# EAGLE design DAQ and eCVT (EAGLE 9.5.2)

## Sheet 1 of 4
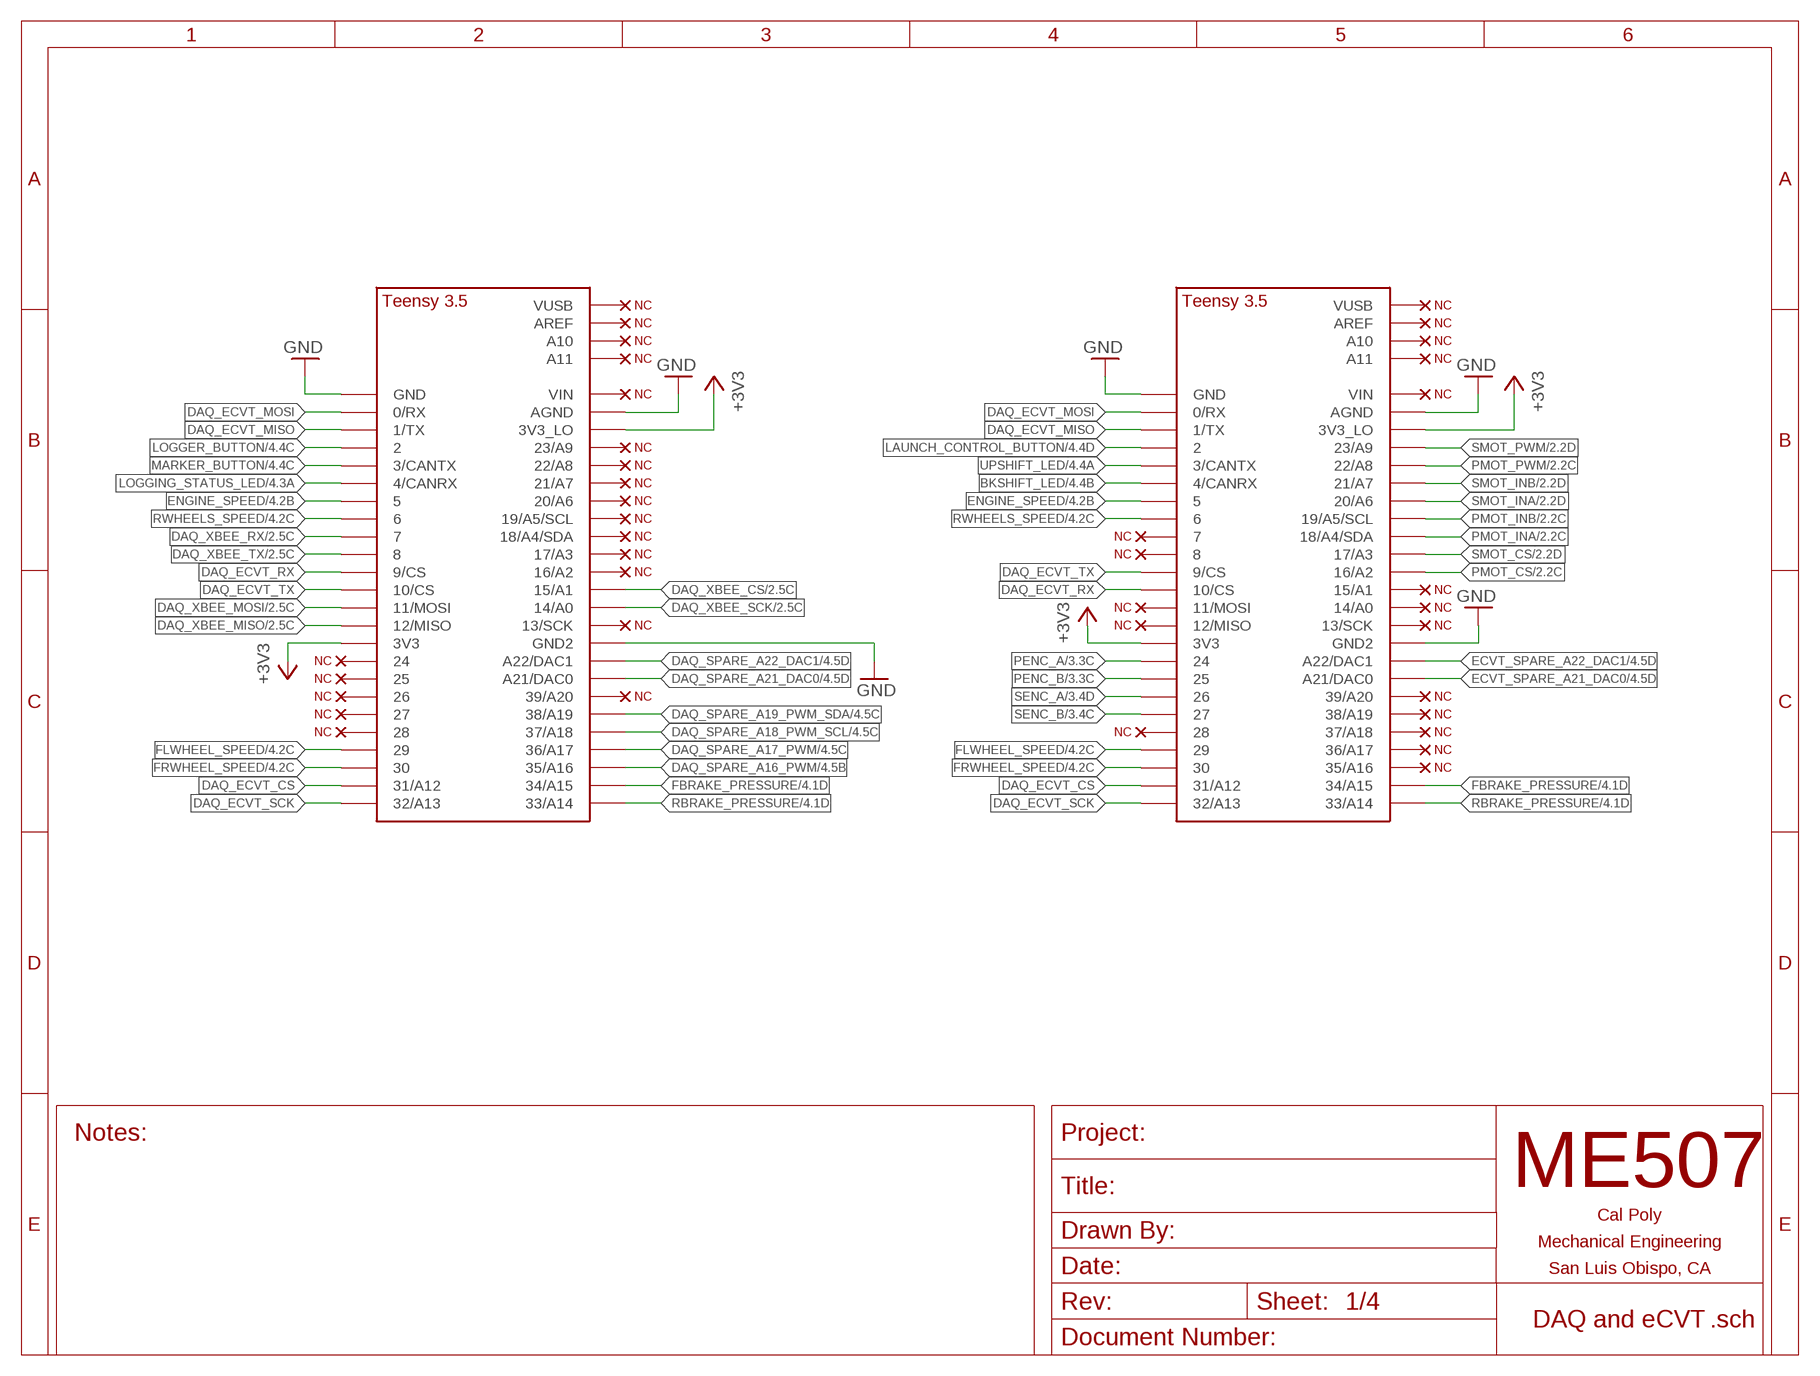
[diagram p0: schematic, sheet 1]

### Parts
DAQ  TEENSY_3.5  [TEENSY_3.5]
ECVT  TEENSY_3.5  [TEENSY_3.5]
U$3  NC  (no package)
U$4  NC  (no package)
U$5  NC  (no package)
U$6  NC  (no package)
U$7  NC  (no package)
U$8  NC  (no package)
U$9  NC  (no package)
U$10  NC  (no package)
U$11  NC  (no package)
U$12  NC  (no package)
U$13  NC  (no package)
U$14  NC  (no package)
U$15  NC  (no package)
U$16  NC  (no package)
U$17  NC  (no package)
U$18  NC  (no package)
U$19  NC  (no package)
U$20  NC  (no package)
U$21  NC  (no package)
U$22  NC  (no package)
U$23  NC  (no package)
U$24  NC  (no package)
U$25  NC  (no package)
U$26  NC  (no package)
U$27  NC  (no package)
U$36  NC  (no package)
U$37  NC  (no package)
U$38  NC  (no package)
U$39  NC  (no package)
U$40  NC  (no package)
U$41  NC  (no package)
U$42  NC  (no package)
U$43  NC  (no package)
U$44  NC  (no package)
U$45  NC  (no package)
U$46  NC  (no package)
U$55  NC  (no package)
U$56  NC  (no package)

### Nets
+3V3: DAQ.3V3 DAQ.3V3_LO ECVT.3V3 ECVT.3V3_LO ; also sheet 2,4
BKSHIFT_LED: ECVT.4/CANRX ; also sheet 4
DAQ_ECVT_CS: DAQ.31/A12 ECVT.31/A12
DAQ_ECVT_MISO: DAQ.1/TX ECVT.1/TX
DAQ_ECVT_MOSI: DAQ.0/RX ECVT.0/RX
DAQ_ECVT_RX: DAQ.9/CS ECVT.10/CS
DAQ_ECVT_SCK: DAQ.32/A13 ECVT.32/A13
DAQ_ECVT_TX: DAQ.10/CS ECVT.9/CS
DAQ_SPARE_A16_PWM: DAQ.35/A16 ; also sheet 4
DAQ_SPARE_A17_PWM: DAQ.36/A17 ; also sheet 4
DAQ_SPARE_A18_PWM_SCL: DAQ.37/A18 ; also sheet 4
DAQ_SPARE_A19_PWM_SDA: DAQ.38/A19 ; also sheet 4
DAQ_SPARE_A21_DAC0: DAQ.21/DAC0(A21/DAC0) ; also sheet 4
DAQ_SPARE_A22_DAC1: DAQ.A22/DAC1 ; also sheet 4
DAQ_XBEE_CS: DAQ.15/A1 ; also sheet 2
DAQ_XBEE_MISO: DAQ.12/MISO ; also sheet 2
DAQ_XBEE_MOSI: DAQ.11/MOSI ; also sheet 2
DAQ_XBEE_RX: DAQ.7 ; also sheet 2
DAQ_XBEE_SCK: DAQ.14/A0 ; also sheet 2
DAQ_XBEE_TX: DAQ.8 ; also sheet 2
ECVT_SPARE_A21_DAC0: ECVT.21/DAC0(A21/DAC0) ; also sheet 4
ECVT_SPARE_A22_DAC1: ECVT.A22/DAC1 ; also sheet 4
ENGINE_SPEED: DAQ.5 ECVT.5 ; also sheet 4
FBRAKE_PRESSURE: DAQ.34/A15 ECVT.34/A15 ; also sheet 4
FLWHEEL_SPEED: DAQ.29 ECVT.29 ; also sheet 4
FRWHEEL_SPEED: DAQ.30 ECVT.30 ; also sheet 4
GND: DAQ.AGND DAQ.GND DAQ.GND2 ECVT.AGND ECVT.GND ECVT.GND2 ; also sheet 2,3,4
LAUNCH_CONTROL_BUTTON: ECVT.2 ; also sheet 4
LOGGER_BUTTON: DAQ.2 ; also sheet 4
LOGGING_STATUS_LED: DAQ.4/CANRX ; also sheet 4
MARKER_BUTTON: DAQ.3/CANTX ; also sheet 4
N$2: DAQ.13/SCK U$4.D
N$3: DAQ.16/A2 U$5.D
N$4: DAQ.17/A3 U$6.D
N$5: DAQ.18/A4/SDA U$7.D
N$6: DAQ.19/A5/SCL U$8.D
N$7: DAQ.20/A6 U$9.D
N$8: DAQ.21/A7 U$10.D
N$9: DAQ.22/A8 U$11.D
N$10: DAQ.23/A9 U$12.D
N$11: DAQ.24 U$13.D
N$12: DAQ.25 U$14.D
N$13: DAQ.26 U$15.D
N$14: DAQ.27 U$16.D
N$15: DAQ.28 U$17.D
N$16: DAQ.VUSB U$18.D
N$17: DAQ.AREF U$19.D
N$18: DAQ.A10 U$20.D
N$19: DAQ.A11 U$21.D
N$20: DAQ.39/A20 U$22.D
N$22: ECVT.13/SCK U$3.D
N$23: ECVT.VUSB U$36.D
N$24: ECVT.28 U$23.D
N$25: ECVT.AREF U$37.D
N$26: ECVT.A10 U$38.D
N$27: ECVT.A11 U$39.D
N$28: ECVT.39/A20 U$40.D
N$29: ECVT.7 U$41.D
N$30: ECVT.8 U$42.D
N$31: ECVT.11/MOSI U$43.D
N$32: ECVT.12/MISO U$44.D
N$33: ECVT.14/A0 U$45.D
N$34: ECVT.15/A1 U$46.D
N$35: ECVT.35/A16 U$24.D
N$36: ECVT.36/A17 U$25.D
N$37: ECVT.37/A18 U$26.D
N$38: ECVT.38/A19 U$27.D
N$54: ECVT.VIN U$55.D
N$55: DAQ.VIN U$56.D
PENC_A: ECVT.24 ; also sheet 3
PENC_B: ECVT.25 ; also sheet 3
PMOT_CS: ECVT.16/A2 ; also sheet 2
PMOT_INA: ECVT.18/A4/SDA ; also sheet 2
PMOT_INB: ECVT.19/A5/SCL ; also sheet 2
PMOT_PWM: ECVT.22/A8 ; also sheet 2
RBRAKE_PRESSURE: DAQ.33/A14 ECVT.33/A14 ; also sheet 4
RWHEELS_SPEED: DAQ.6 ECVT.6 ; also sheet 4
SENC_A: ECVT.26 ; also sheet 3
SENC_B: ECVT.27 ; also sheet 3
SMOT_CS: ECVT.17/A3 ; also sheet 2
SMOT_INA: ECVT.20/A6 ; also sheet 2
SMOT_INB: ECVT.21/A7 ; also sheet 2
SMOT_PWM: ECVT.23/A9 ; also sheet 2
UPSHIFT_LED: ECVT.3/CANTX ; also sheet 4

## Sheet 2 of 4
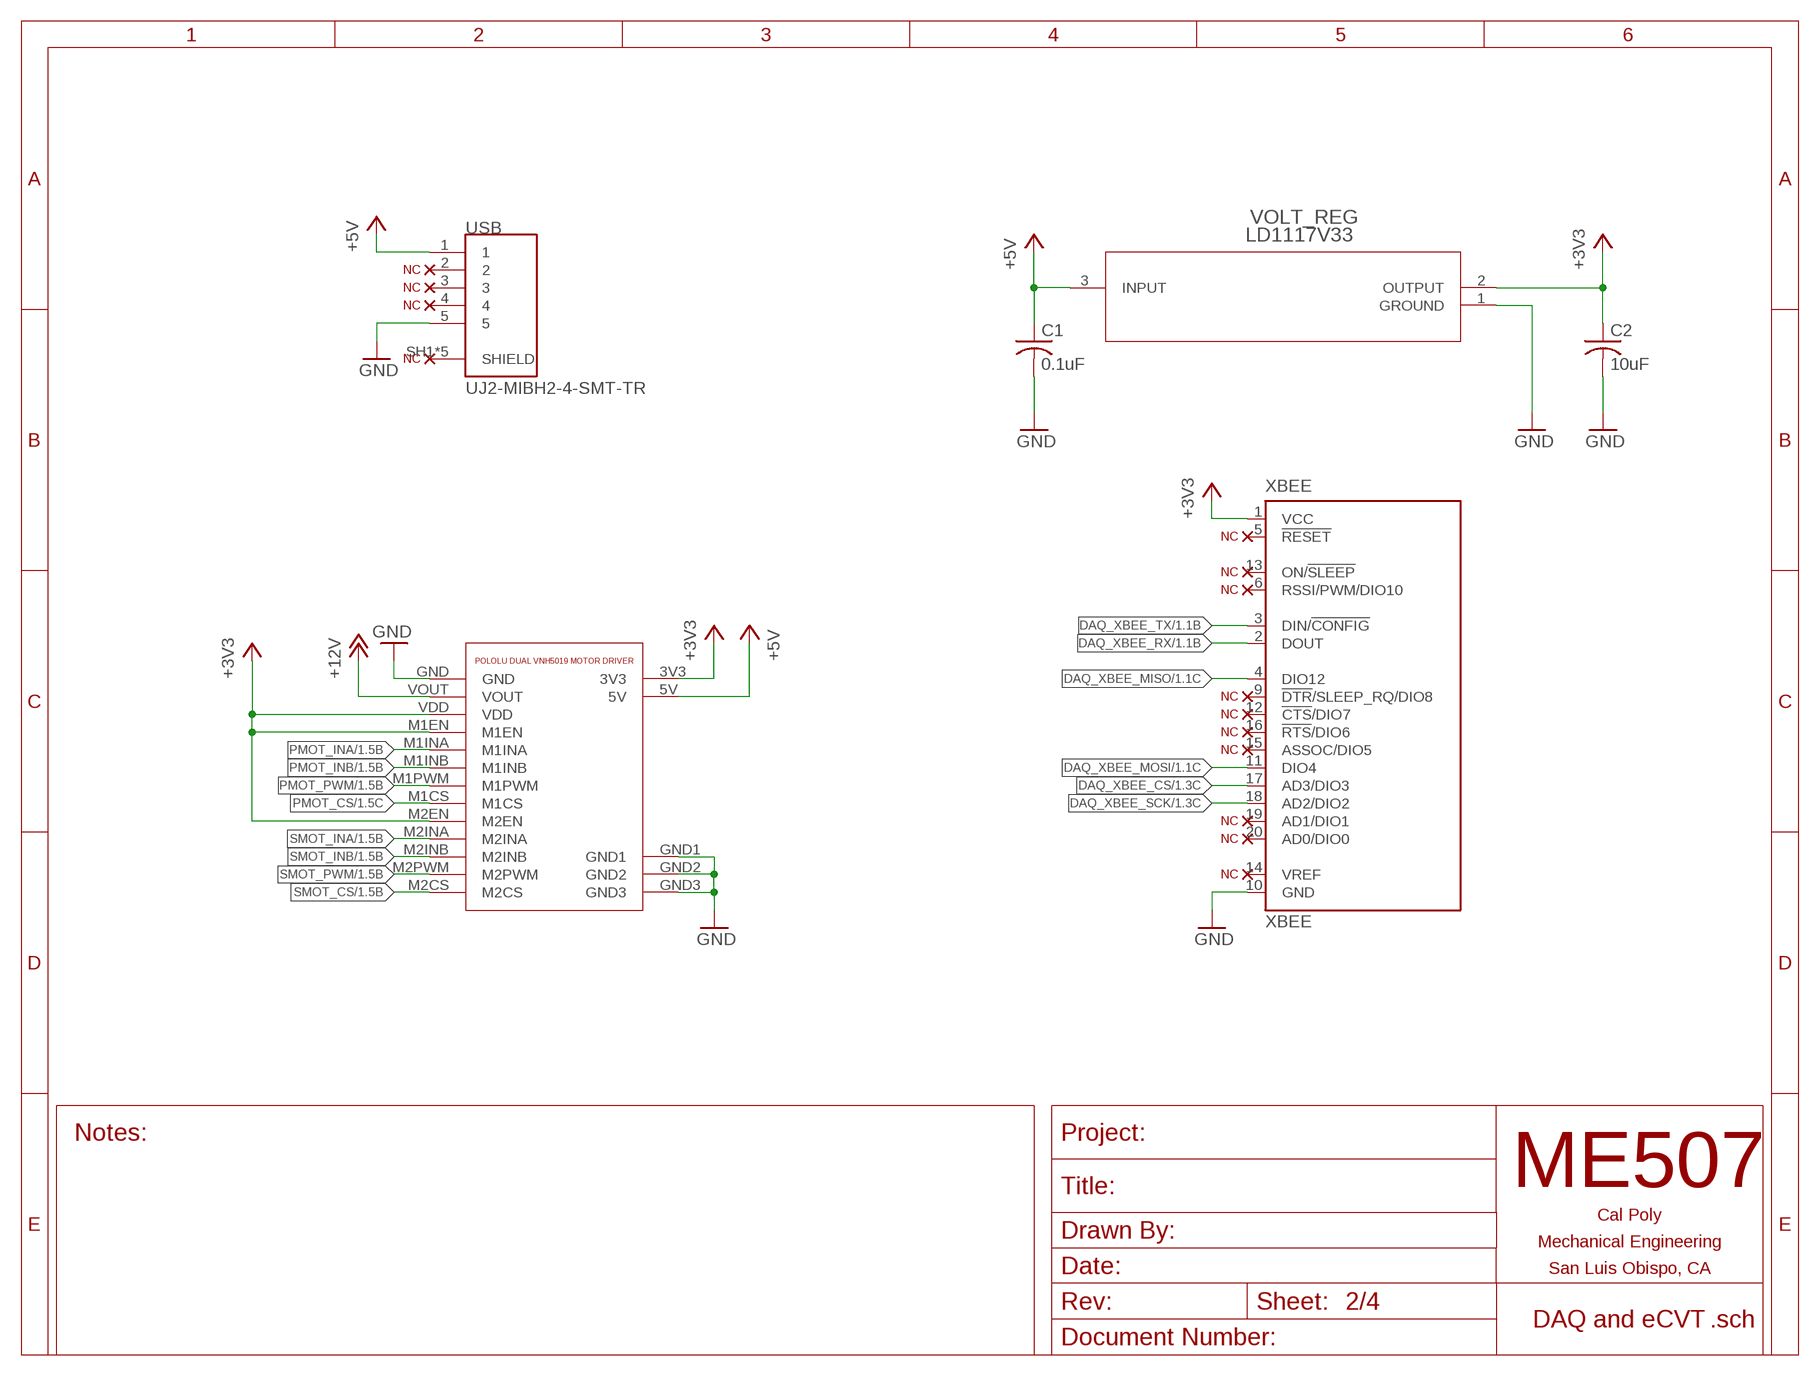
[diagram p1: schematic, sheet 2]

### Parts
C1  0.1uF  C-USC0805  [C0805]
C2  10uF  C-USC0805  [C0805]
MOTOR_DRIVER  POLOLU_DUAL_VNH5019  [POLOLU_DUAL_VNH5019]
U$28  NC  (no package)
U$29  NC  (no package)
U$30  NC  (no package)
U$31  NC  (no package)
U$34  NC  (no package)
U$35  NC  (no package)
U$47  NC  (no package)
U$48  NC  (no package)
U$49  NC  (no package)
U$50  NC  (no package)
U$51  NC  (no package)
U$52  NC  (no package)
U$53  NC  (no package)
U$54  NC  (no package)
USB  UJ2-MIBH2-4-SMT-TR  [CUI_UJ2-MIBH2-4-SMT-TR]
VOLT_REG  LD1117V33  [TO-220]
XBEE  XBEE  [XBEE]

### Nets
+3V3: C2.1 MOTOR_DRIVER.3V3 MOTOR_DRIVER.M1EN MOTOR_DRIVER.M2EN MOTOR_DRIVER.VDD VOLT_REG.2(OUTPUT) XBEE.1(VCC) ; also sheet 1,4
+5V: C1.1 MOTOR_DRIVER.5V USB.1 VOLT_REG.3(INPUT) ; also sheet 3,4
+12V: MOTOR_DRIVER.VOUT ; also sheet 4
DAQ_XBEE_CS: XBEE.17(AD3/DIO3) ; also sheet 1
DAQ_XBEE_MISO: XBEE.4(DIO12) ; also sheet 1
DAQ_XBEE_MOSI: XBEE.11(DIO4) ; also sheet 1
DAQ_XBEE_RX: XBEE.2(DOUT) ; also sheet 1
DAQ_XBEE_SCK: XBEE.18(AD2/DIO2) ; also sheet 1
DAQ_XBEE_TX: XBEE.3(DIN/!CONFIG) ; also sheet 1
GND: C1.2 C2.2 MOTOR_DRIVER.GND MOTOR_DRIVER.GND1 MOTOR_DRIVER.GND2 MOTOR_DRIVER.GND3 USB.5 VOLT_REG.1(GROUND) XBEE.10(GND) ; also sheet 1,3,4
N$1: U$28.D USB.2
N$21: U$29.D USB.3
N$39: U$30.D USB.4
N$40: U$31.D USB.SH1(SHIELD) USB.SH2(SHIELD) USB.SH3(SHIELD) USB.SH4(SHIELD) USB.SH5(SHIELD)
N$43: U$34.D XBEE.5(!RESET)
N$45: U$35.D XBEE.13(ON/!SLEEP)
N$46: U$47.D XBEE.6(RSSI/PWM/DIO10)
N$47: U$48.D XBEE.9(!DTR!/SLEEP_RQ/DIO8)
N$48: U$49.D XBEE.12(!CTS!/DIO7)
N$49: U$50.D XBEE.16(!RTS!/DIO6)
N$50: U$51.D XBEE.15(ASSOC/DIO5)
N$51: U$52.D XBEE.19(AD1/DIO1)
N$52: U$53.D XBEE.20(AD0/DIO0)
N$53: U$54.D XBEE.14(VREF)
PMOT_CS: MOTOR_DRIVER.M1CS ; also sheet 1
PMOT_INA: MOTOR_DRIVER.M1INA ; also sheet 1
PMOT_INB: MOTOR_DRIVER.M1INB ; also sheet 1
PMOT_PWM: MOTOR_DRIVER.M1PWM ; also sheet 1
SMOT_CS: MOTOR_DRIVER.M2CS ; also sheet 1
SMOT_INA: MOTOR_DRIVER.M2INA ; also sheet 1
SMOT_INB: MOTOR_DRIVER.M2INB ; also sheet 1
SMOT_PWM: MOTOR_DRIVER.M2PWM ; also sheet 1

## Sheet 3 of 4
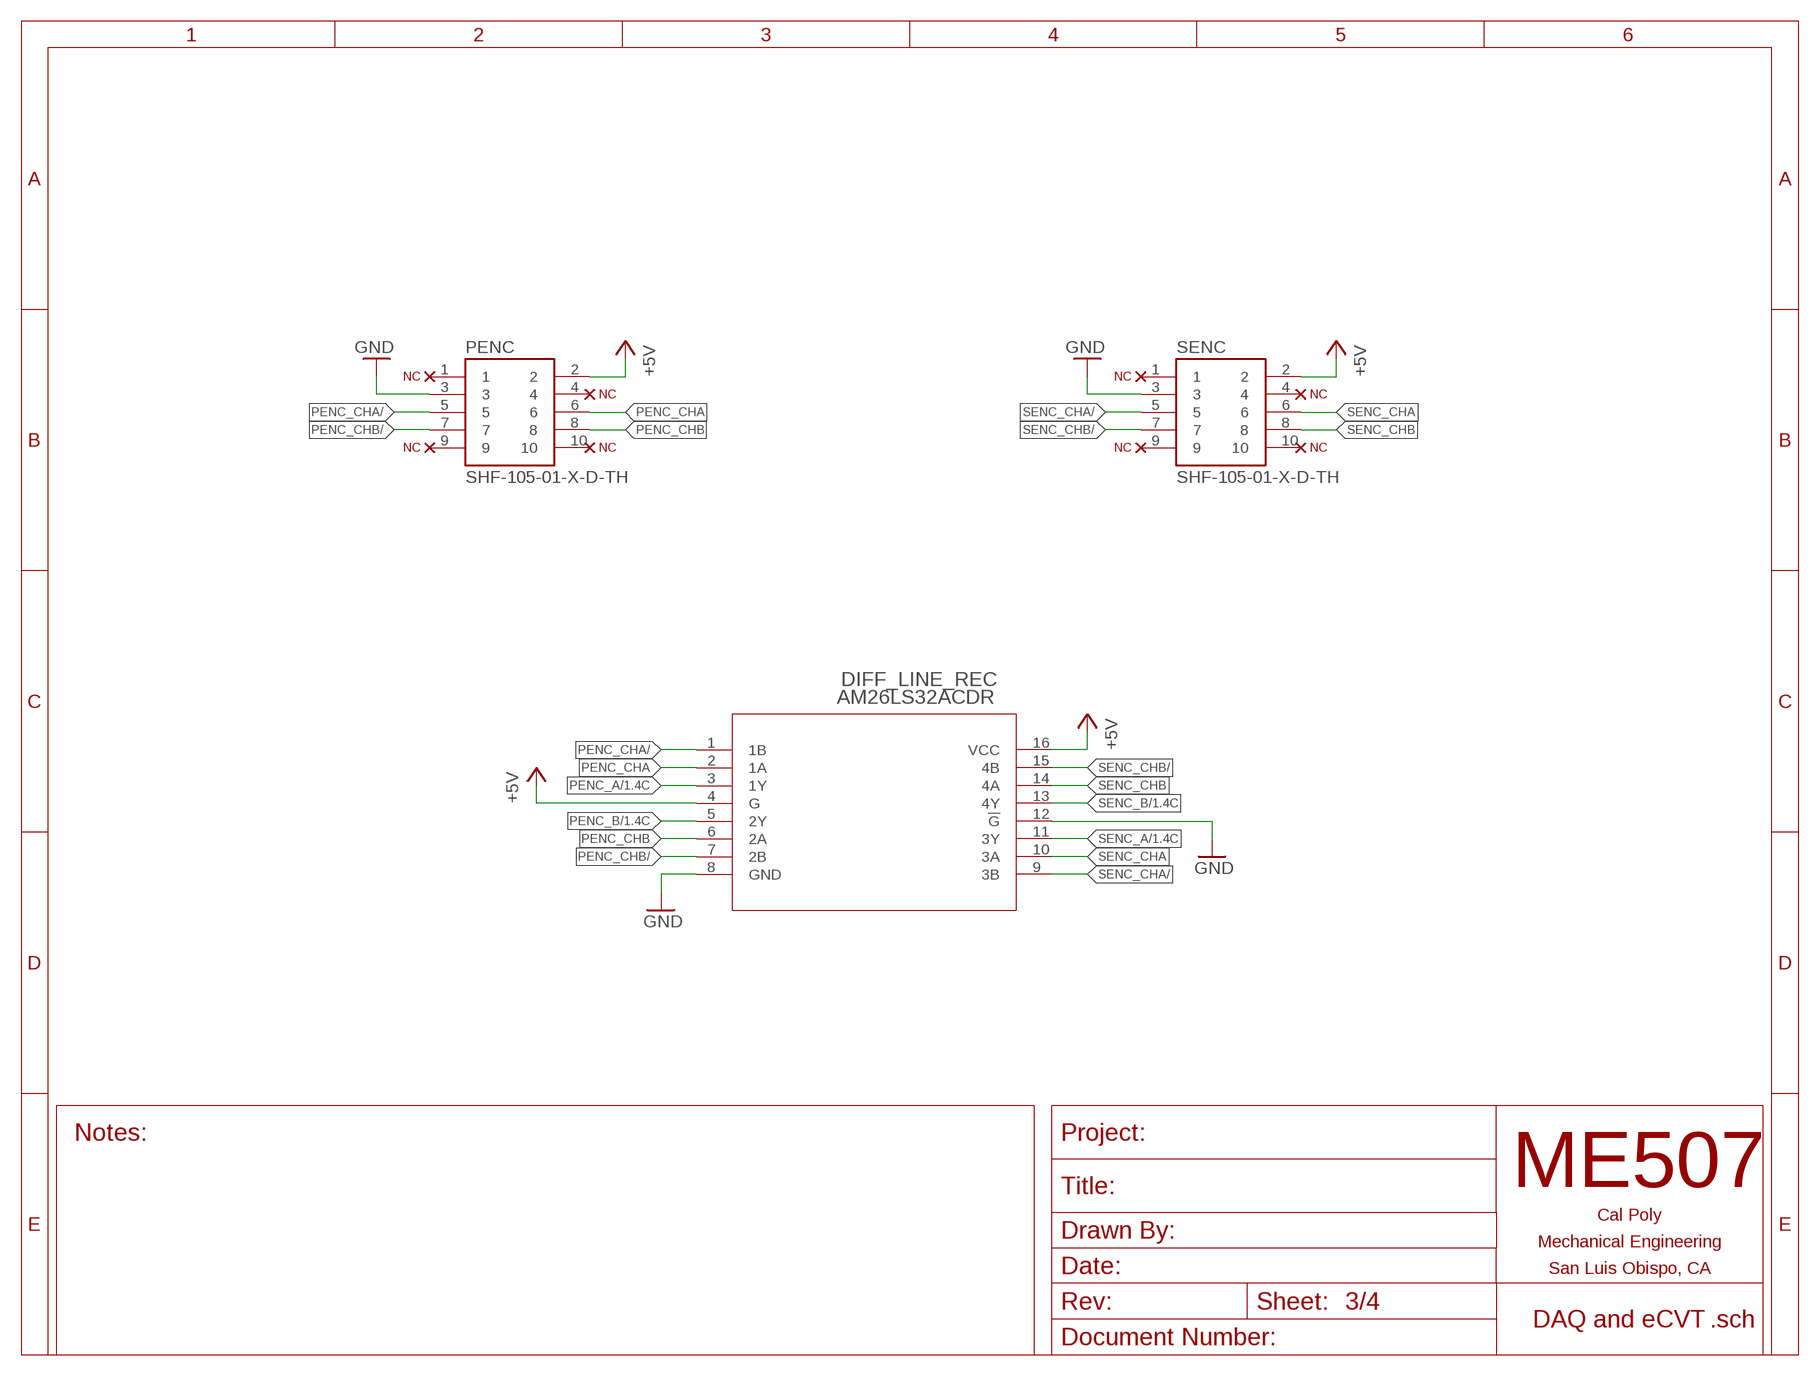
[diagram p2: schematic, sheet 3]

### Parts
DIFF_LINE_REC  AM26LS32ACDR  [D16]
PENC  SHF-105-01-X-D-TH  [SHF-105-01-X-D-TH]
SENC  SHF-105-01-X-D-TH  [SHF-105-01-X-D-TH]
U$59  NC  (no package)
U$60  NC  (no package)
U$61  NC  (no package)
U$62  NC  (no package)
U$63  NC  (no package)
U$64  NC  (no package)
U$65  NC  (no package)
U$66  NC  (no package)

### Nets
+5V: DIFF_LINE_REC.4(G) DIFF_LINE_REC.16(VCC) PENC.2 SENC.2 ; also sheet 2,4
GND: DIFF_LINE_REC.8(GND) DIFF_LINE_REC.12(!G) PENC.3 SENC.3 ; also sheet 1,2,4
N$56: PENC.9 U$61.D
N$59: PENC.10 U$62.D
N$64: PENC.4 U$59.D
N$65: PENC.1 U$60.D
N$68: SENC.4 U$63.D
N$69: SENC.10 U$64.D
N$70: SENC.1 U$65.D
N$71: SENC.9 U$66.D
PENC_A: DIFF_LINE_REC.3(1Y) ; also sheet 1
PENC_B: DIFF_LINE_REC.5(2Y) ; also sheet 1
PENC_CHA: DIFF_LINE_REC.2(1A) PENC.6
PENC_CHA/: DIFF_LINE_REC.1(1B) PENC.5
PENC_CHB: DIFF_LINE_REC.6(2A) PENC.8
PENC_CHB/: DIFF_LINE_REC.7(2B) PENC.7
SENC_A: DIFF_LINE_REC.11(3Y) ; also sheet 1
SENC_B: DIFF_LINE_REC.13(4Y) ; also sheet 1
SENC_CHA: DIFF_LINE_REC.10(3A) SENC.6
SENC_CHA/: DIFF_LINE_REC.9(3B) SENC.5
SENC_CHB: DIFF_LINE_REC.14(4A) SENC.8
SENC_CHB/: DIFF_LINE_REC.15(4B) SENC.7

## Sheet 4 of 4
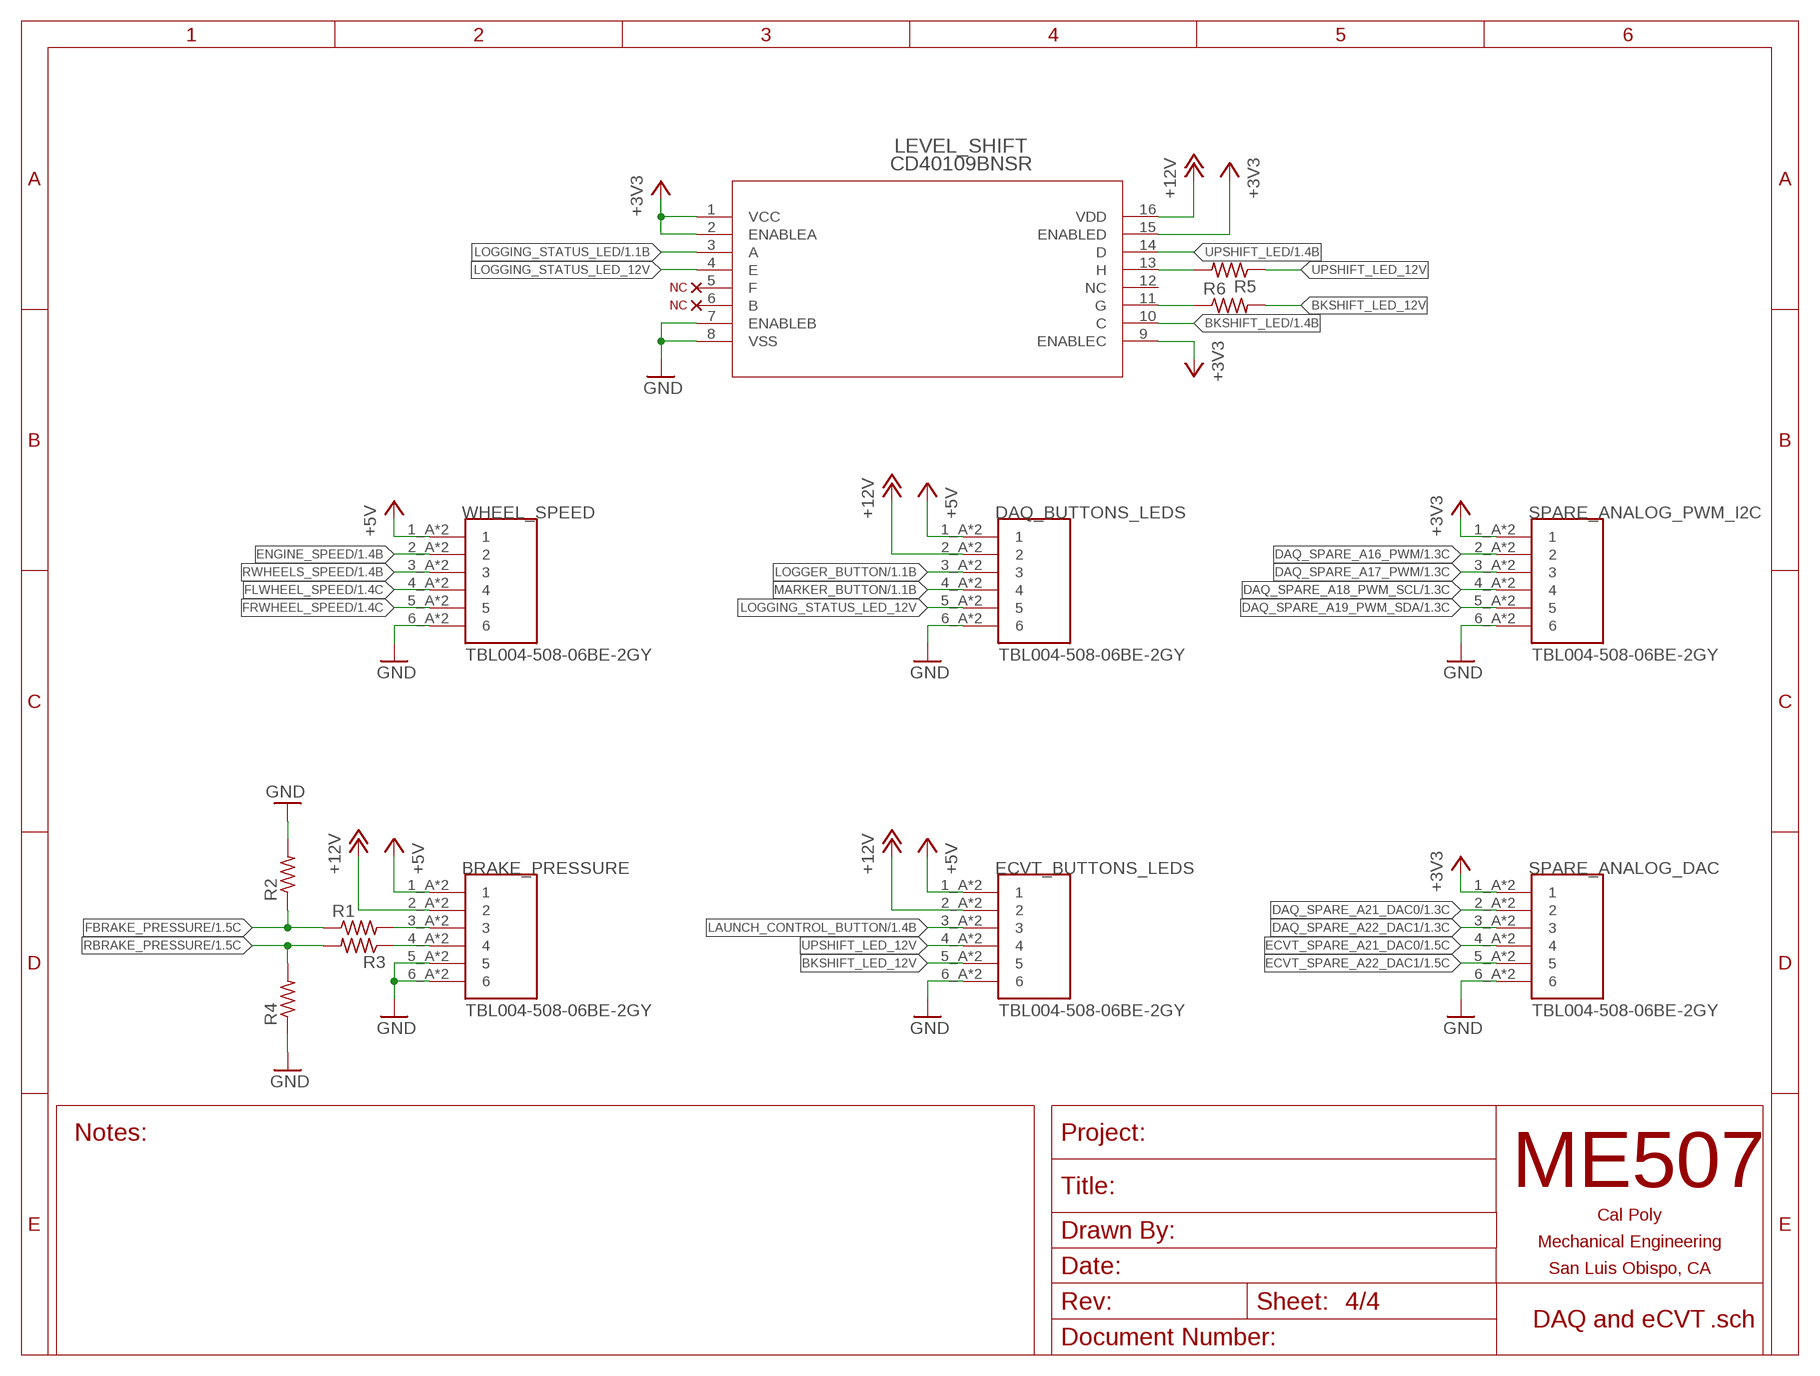
[diagram p3: schematic, sheet 4]

### Parts
BRAKE_PRESSURE  TBL004-508-06BE-2GY  [CUI_TBL004-508-06BE-2GY]
DAQ_BUTTONS_LEDS  TBL004-508-06BE-2GY  [CUI_TBL004-508-06BE-2GY]
ECVT_BUTTONS_LEDS  TBL004-508-06BE-2GY  [CUI_TBL004-508-06BE-2GY]
LEVEL_SHIFT  CD40109BNSR  [NS16]
R1  R-US_0204/7  [0204/7]
R2  R-US_0204/7  [0204/7]
R3  R-US_0204/7  [0204/7]
R4  R-US_0204/7  [0204/7]
R5  R-US_0204/7  [0204/7]
R6  R-US_0204/7  [0204/7]
SPARE_ANALOG_DAC  TBL004-508-06BE-2GY  [CUI_TBL004-508-06BE-2GY]
SPARE_ANALOG_PWM_I2C  TBL004-508-06BE-2GY  [CUI_TBL004-508-06BE-2GY]
U$67  NC  (no package)
U$68  NC  (no package)
WHEEL_SPEED  TBL004-508-06BE-2GY  [CUI_TBL004-508-06BE-2GY]

### Nets
+3V3: LEVEL_SHIFT.1(VCC) LEVEL_SHIFT.2(ENABLEA) LEVEL_SHIFT.9(ENABLEC) LEVEL_SHIFT.15(ENABLED) SPARE_ANALOG_DAC.1_A SPARE_ANALOG_DAC.1_B SPARE_ANALOG_PWM_I2C.1_A SPARE_ANALOG_PWM_I2C.1_B ; also sheet 1,2
+5V: BRAKE_PRESSURE.1_A BRAKE_PRESSURE.1_B DAQ_BUTTONS_LEDS.1_A DAQ_BUTTONS_LEDS.1_B ECVT_BUTTONS_LEDS.1_A ECVT_BUTTONS_LEDS.1_B WHEEL_SPEED.1_A WHEEL_SPEED.1_B ; also sheet 2,3
+12V: BRAKE_PRESSURE.2_A BRAKE_PRESSURE.2_B DAQ_BUTTONS_LEDS.2_A DAQ_BUTTONS_LEDS.2_B ECVT_BUTTONS_LEDS.2_A ECVT_BUTTONS_LEDS.2_B LEVEL_SHIFT.16(VDD) ; also sheet 2
BACKSHIFT_LED_12V_W/O_RES: LEVEL_SHIFT.11(G) R6.1
BKSHIFT_LED: LEVEL_SHIFT.10(C) ; also sheet 1
BKSHIFT_LED_12V: ECVT_BUTTONS_LEDS.5_A ECVT_BUTTONS_LEDS.5_B R6.2
DAQ_SPARE_A16_PWM: SPARE_ANALOG_PWM_I2C.2_A SPARE_ANALOG_PWM_I2C.2_B ; also sheet 1
DAQ_SPARE_A17_PWM: SPARE_ANALOG_PWM_I2C.3_A SPARE_ANALOG_PWM_I2C.3_B ; also sheet 1
DAQ_SPARE_A18_PWM_SCL: SPARE_ANALOG_PWM_I2C.4_A SPARE_ANALOG_PWM_I2C.4_B ; also sheet 1
DAQ_SPARE_A19_PWM_SDA: SPARE_ANALOG_PWM_I2C.5_A SPARE_ANALOG_PWM_I2C.5_B ; also sheet 1
DAQ_SPARE_A21_DAC0: SPARE_ANALOG_DAC.2_A SPARE_ANALOG_DAC.2_B ; also sheet 1
DAQ_SPARE_A22_DAC1: SPARE_ANALOG_DAC.3_A SPARE_ANALOG_DAC.3_B ; also sheet 1
ECVT_SPARE_A21_DAC0: SPARE_ANALOG_DAC.4_A SPARE_ANALOG_DAC.4_B ; also sheet 1
ECVT_SPARE_A22_DAC1: SPARE_ANALOG_DAC.5_A SPARE_ANALOG_DAC.5_B ; also sheet 1
ENGINE_SPEED: WHEEL_SPEED.2_A WHEEL_SPEED.2_B ; also sheet 1
FBRAKE_PRESSURE: R1.1 R2.1 ; also sheet 1
FBRAKE_PRESSURE_W/O_RES: BRAKE_PRESSURE.3_A BRAKE_PRESSURE.3_B R1.2
FLWHEEL_SPEED: WHEEL_SPEED.4_A WHEEL_SPEED.4_B ; also sheet 1
FRWHEEL_SPEED: WHEEL_SPEED.5_A WHEEL_SPEED.5_B ; also sheet 1
GND: BRAKE_PRESSURE.5_A BRAKE_PRESSURE.5_B BRAKE_PRESSURE.6_A BRAKE_PRESSURE.6_B DAQ_BUTTONS_LEDS.6_A DAQ_BUTTONS_LEDS.6_B ECVT_BUTTONS_LEDS.6_A ECVT_BUTTONS_LEDS.6_B LEVEL_SHIFT.7(ENABLEB) LEVEL_SHIFT.8(VSS) R2.2 R4.1 SPARE_ANALOG_DAC.6_A SPARE_ANALOG_DAC.6_B SPARE_ANALOG_PWM_I2C.6_A SPARE_ANALOG_PWM_I2C.6_B WHEEL_SPEED.6_A WHEEL_SPEED.6_B ; also sheet 1,2,3
LAUNCH_CONTROL_BUTTON: ECVT_BUTTONS_LEDS.3_A ECVT_BUTTONS_LEDS.3_B ; also sheet 1
LOGGER_BUTTON: DAQ_BUTTONS_LEDS.3_A DAQ_BUTTONS_LEDS.3_B ; also sheet 1
LOGGING_STATUS_LED: LEVEL_SHIFT.3(A) ; also sheet 1
LOGGING_STATUS_LED_12V: DAQ_BUTTONS_LEDS.5_A DAQ_BUTTONS_LEDS.5_B LEVEL_SHIFT.4(E)
MARKER_BUTTON: DAQ_BUTTONS_LEDS.4_A DAQ_BUTTONS_LEDS.4_B ; also sheet 1
N$58: LEVEL_SHIFT.5(F) U$67.D
N$60: LEVEL_SHIFT.6(B) U$68.D
RBRAKE_PRESSURE: R3.2 R4.2 ; also sheet 1
RBRAKE_PRESSURE_W/O_RES: BRAKE_PRESSURE.4_A BRAKE_PRESSURE.4_B R3.1
RWHEELS_SPEED: WHEEL_SPEED.3_A WHEEL_SPEED.3_B ; also sheet 1
UPSHIFT_LED: LEVEL_SHIFT.14(D) ; also sheet 1
UPSHIFT_LED_12V: ECVT_BUTTONS_LEDS.4_A ECVT_BUTTONS_LEDS.4_B R5.1
UPSHIFT_LED_12V_W/O_RES: LEVEL_SHIFT.13(H) R5.2
Unconnected: LEVEL_SHIFT.12(NC)

## Library data of the parts
BRAKE_PRESSURE DAQ_BUTTONS_LEDS ECVT_BUTTONS_LEDS SPARE_ANALOG_DAC SPARE_ANALOG_PWM_I2C WHEEL_SPEED = Screwless Terminal 6-Pole:TBL004-508-06BE-2GY; MANUFACTURER: CUI; STANDARD: Manufacturer Recommendations
C1 C2 = rcl:C-US: CAPACITOR, American symbol; SPICEPREFIX: C
DAQ ECVT = Teensy:TEENSY_3.5
DIFF_LINE_REC = Quad. Diff. Line Receiver:AM26LS32ACDR; BUILT_BY: EMA_UL_Team; MANUFACTURER: Texas Instruments; MANUFACTURER_PART_NUMBER: AM26LS32ACDR; VENDOR: Texas Instruments
LEVEL_SHIFT = Quad. Level Shifter:CD40109BNSR; BUILT_BY: EMA_UL_Team; MANUFACTURER: Texas Instruments; MANUFACTURER_PART_NUMBER: CD40109BNSR; VENDOR: Texas Instruments
MOTOR_DRIVER = Pololo Dual VNH5019:POLOLU_DUAL_VNH5019
PENC SENC = Male Header 2x5 0.05in:SHF-105-01-X-D-TH: .050 x .050 SHROUDED TERMINAL STRIP.; DESCRIPTION: SHF Series .050 Shrouded Terminal Strip For FFSD; DIGI-KEY_PART_NUMBER: SAM10711-ND; DIGI-KEY_PURCHASE_URL: https://www.digikey.com/product-detail/en/samtec-inc/SHF-105-01-L-D-TH/SAM10711-ND/6561671?utm_source=snapeda&utm_medium=aggregator&utm_campaign=symbol; MF: Samtec; MP: SHF-105-01-L-D-TH; PACKAGE: None
R1-R6 = rcl:R-US_: RESISTOR, American symbol; SPICEPREFIX: R
U$3-U$31 U$34-U$56 = ME507:NC
U$59-U$68 = ME 507:NC
USB = Micro USB:UJ2-MIBH2-4-SMT-TR: Micro B Type 5 Pin Horizontal 30 µin Plating SMT USB Jack 2.0; CUI_PURCHASE_URL: https://www.cuidevices.com/product/interconnect/connectors/usb-connectors/uj2-mibh2-4-smt?utm_source=snapeda.com&utm_medium=referral&utm_campaign=snapedaBOM; DESCRIPTION: Micro B, USB 2.0, 1.8 A, Right Angle, Surface Mount _SMT_, USB Receptacle; DIGI-KEY_PART_NUMBER: 102-4007-1-ND; DIGI-KEY_PURCHASE_URL: https://www.digikey.com/product-detail/en/cui-devices/UJ2-MIBH2-4-SMT-TR/102-4007-1-ND/6187929?utm_source=snapeda&utm_medium=aggregator&utm_campaign=symbol; MF: CUI Devices; MP: UJ2-MIBH2-4-SMT-TR; PACKAGE: None
VOLT_REG = Voltage Regulator 3.3V:LD1117V33; BUILT_BY: EMA_UL_Team; MANUFACTURER_PART_NUMBER: LD1117V33; VENDOR: STMicroelectronics
XBEE = Xbee:XBEE: XBee (TM) /XBee-PRO(TM) OEM RF Modules Source: MaxStream, Inc. xbee_productmanual.pdf; MPN: XBP24-Z7UIT-004; OC_FARNELL: 1751799; OC_NEWARK: 34R5507

## Board
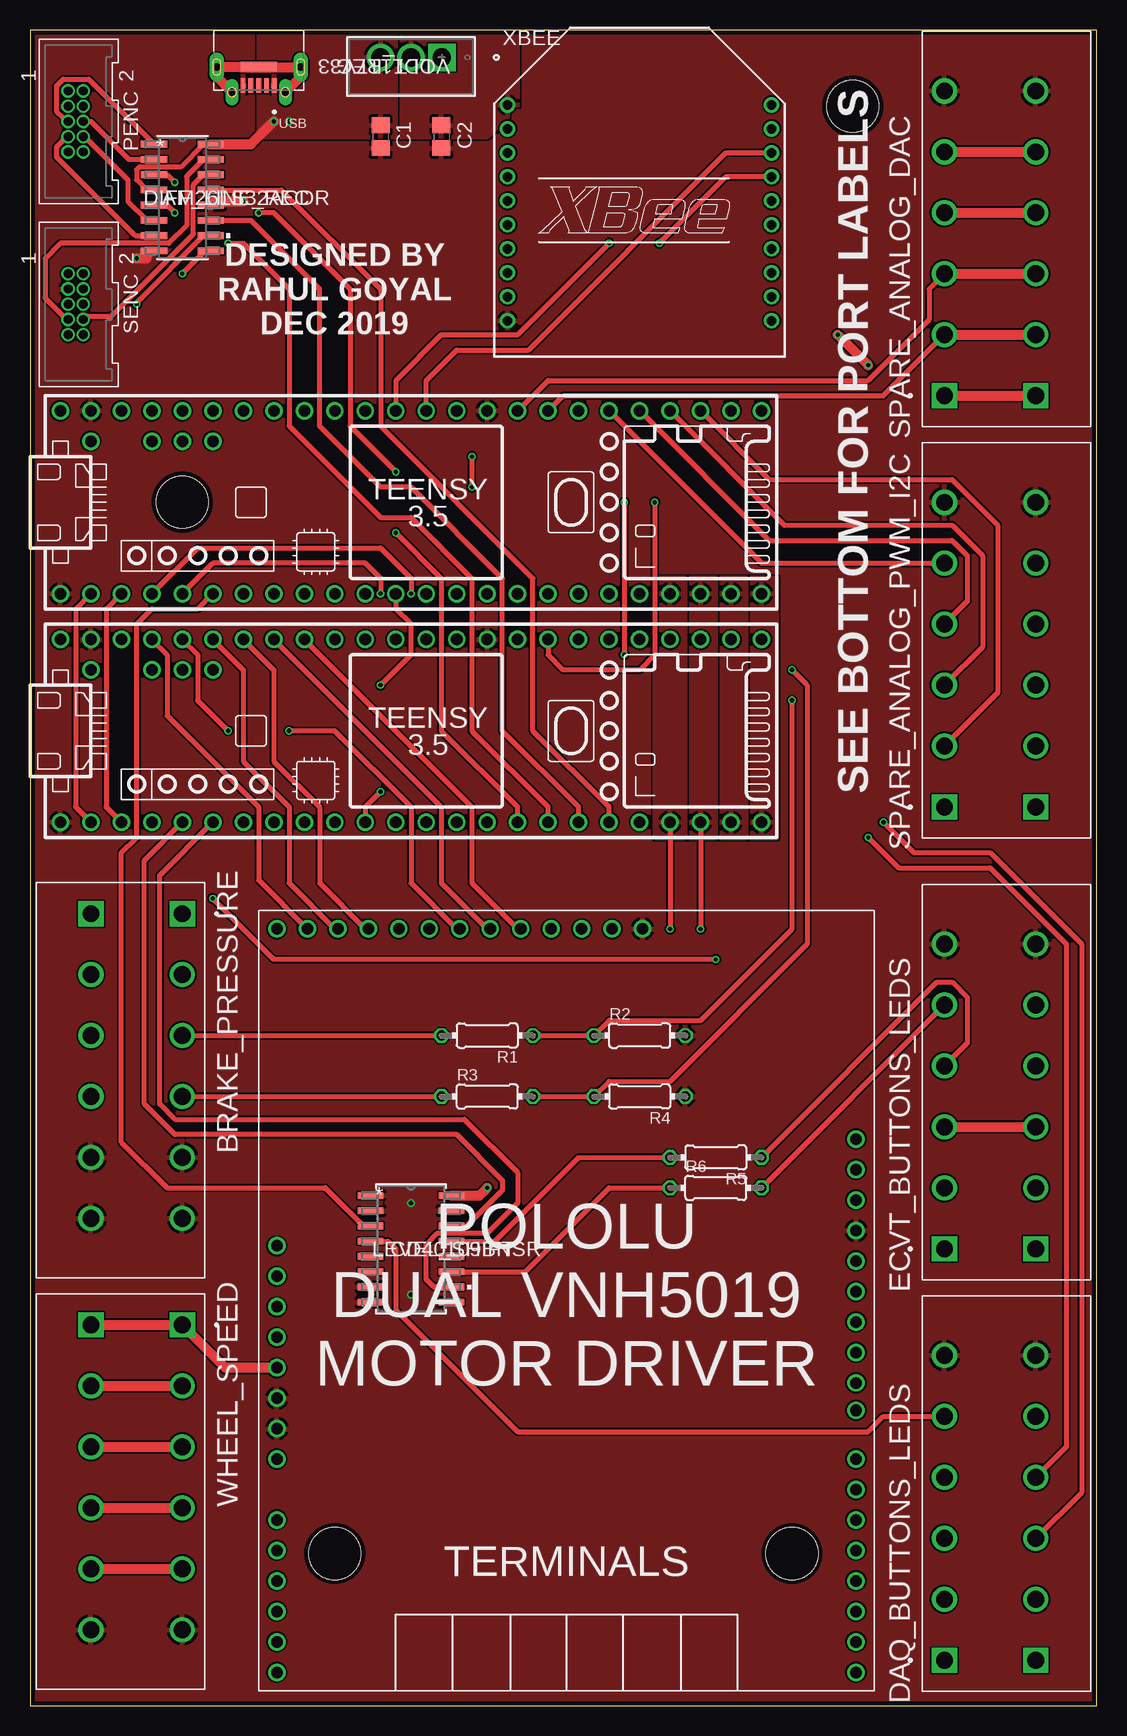
[diagram p4: board, top side]
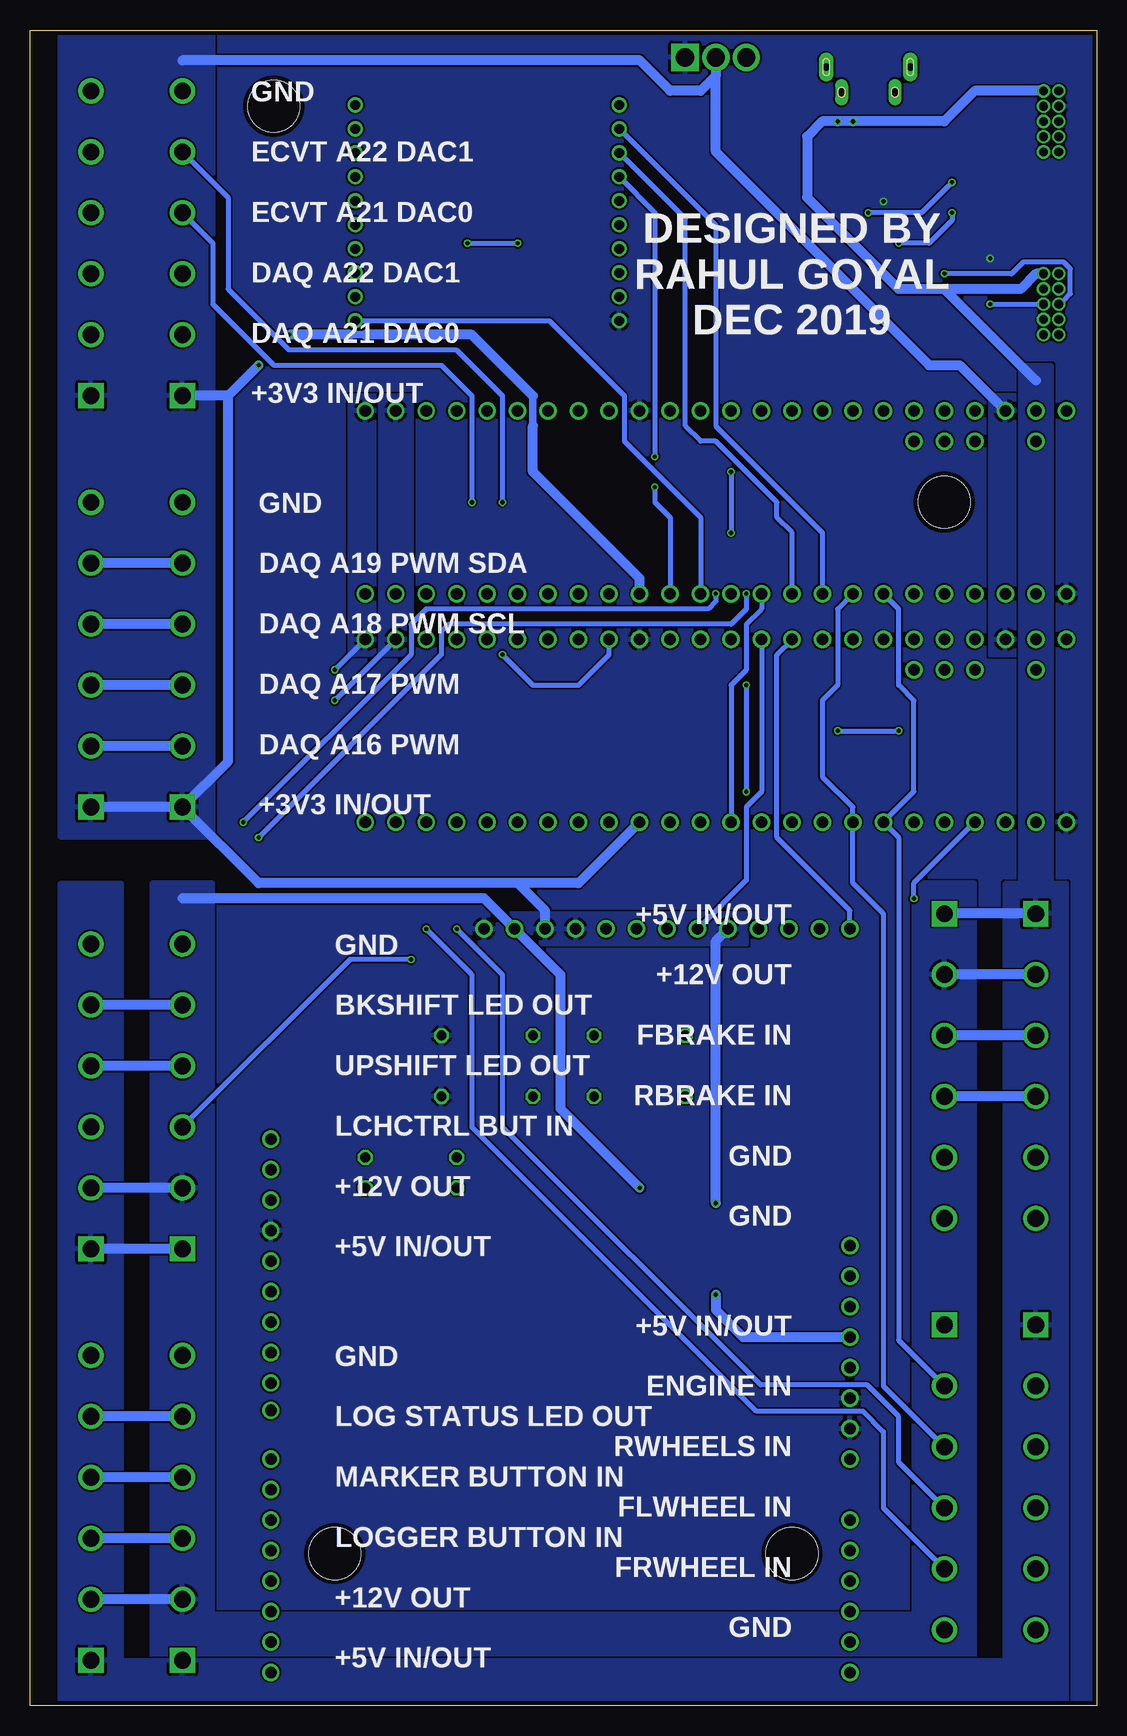
[diagram p5: board, bottom side, seen from below]

Size 88.9 x 139.7 mm. Coordinates in mm from the lower left corner, seen from the top.
Outline: 0,0 88.88,0 88.9,139.7 0,139.7 0,0
Copper layers (1*16): Top 0.035559375mm / dielectric 1.6mm / Bottom 0.035559375mm
Design rules "oshpark-2layer": minimum track width 6mil, minimum drill 10mil, track to track 6mil, track to pad 6mil, pad to pad 6mil, via to via 6mil, smd to smd 6mil, copper to edge 15mil, drill to drill 6mil, minimum pad ring 5mil, minimum via ring 5mil, stop-mask expansion 2.5mil, vias tented up to drill 0mil, thermal gap 10mil
Holes 4.32 mm at 25.4,12.7 63.5,12.7 12.7,100.33 68.58,133.35

### Footprints (pad centres in the part's own frame; a part is rotated, then mirrored left to right if it is on the bottom)
CUI_TBL004-508-06BE-2GY = drill 1.4 square: 1_A 0,0; 1_B 0,-7.62 | drill 1.4: 2_A 5.08,0; 2_B 5.08,-7.62; 3_A 10.16,0; 3_B 10.16,-7.62; 4_A 15.24,0; 4_B 15.24,-7.62; 5_A 20.32,0; 5_B 20.32,-7.62; 6_A 25.4,0; 6_B 25.4,-7.62
C0805 = smd 1.3 x 1.5: 1 -0.95,0; 2 0.95,0
TEENSY_3.5 = drill 0.965: 0/RX 3.81,1.27; 1/TX 6.35,1.27; 2 8.89,1.27; 3/CANTX 11.43,1.27; 3V3 36.83,1.27; 3V3_LO 6.35,16.51; 4/CANRX 13.97,1.27; 5 16.51,1.27; 6 19.05,1.27; 7 21.59,1.27; 8 24.13,1.27; 9/CS 26.67,1.27; 10/CS 29.21,1.27; 11/MOSI 31.75,1.27; 12/MISO 34.29,1.27; 13/SCK 34.29,16.51; 14/A0 31.75,16.51; 15/A1 29.21,16.51; 16/A2 26.67,16.51; 17/A3 24.13,16.51; 18/A4/SDA 21.59,16.51; 19/A5/SCL 19.05,16.51; 20/A6 16.51,16.51; 21/A7 13.97,16.51; 21/DAC0 41.91,16.51; 22/A8 11.43,16.51; 23/A9 8.89,16.51; 24 39.37,1.27; 25 41.91,1.27; 26 44.45,1.27; 27 46.99,1.27; 28 49.53,1.27; 29 52.07,1.27; 30 54.61,1.27; 31/A12 57.15,1.27; 32/A13 59.69,1.27; 33/A14 59.69,16.51; 34/A15 57.15,16.51; 35/A16 54.61,16.51; 36/A17 52.07,16.51; 37/A18 49.53,16.51; 38/A19 46.99,16.51; 39/A20 44.45,16.51; A10 11.43,13.97; A11 13.97,13.97; A22/DAC1 39.37,16.51; AGND 3.81,16.51; AREF 8.89,13.97; GND 1.27,1.27; GND2 36.83,16.51; VIN 1.27,16.51; VUSB 3.81,13.97
D16 = smd 2.184 x 0.559: 1 -2.362,4.445; 2 -2.362,3.175; 3 -2.362,1.905; 4 -2.362,0.635; 5 -2.362,-0.635; 6 -2.362,-1.905; 7 -2.362,-3.175; 8 -2.362,-4.445; 9 2.362,-4.445; 10 2.362,-3.175; 11 2.362,-1.905; 12 2.362,-0.635; 13 2.362,0.635; 14 2.362,1.905; 15 2.362,3.175; 16 2.362,4.445
NS16 = smd 2.159 x 0.559: 1 -3.378,4.445; 2 -3.378,3.175; 3 -3.378,1.905; 4 -3.378,0.635; 5 -3.378,-0.635; 6 -3.378,-1.905; 7 -3.378,-3.175; 8 -3.378,-4.445; 9 3.378,-4.445; 10 3.378,-3.175; 11 3.378,-1.905; 12 3.378,-0.635; 13 3.378,0.635; 14 3.378,1.905; 15 3.378,3.175; 16 3.378,4.445
POLOLU_DUAL_VNH5019 = drill 0.965: 0 49.784,1.524; 1 49.784,4.064; 2 49.784,6.604; 3 49.784,9.144; 3V3 1.524,29.464; 4 49.784,11.684; 5 49.784,14.224; 5V 1.524,26.924; 6 49.784,16.764; 7 49.784,19.304; 8 49.784,23.368; 9 49.784,25.654; 10 49.784,28.194; 11 49.784,30.734; 12 49.784,33.274; 13 49.784,35.814; 14 1.524,14.224; 15 1.524,11.684; 16 1.524,9.144; 17 1.524,6.604; 18 49.784,43.434; 19 49.784,45.974; 20 1.524,4.064; 21 1.524,1.524; AREF 49.784,40.894; GND 32.004,63.5; GND1 1.524,24.384; GND2 1.524,21.844; GND3 49.784,38.354; IOREF 1.524,34.544; M1CS 14.224,63.5; M1EN 24.384,63.5; M1INA 21.844,63.5; M1INB 19.304,63.5; M1PWM 16.764,63.5; M2CS 1.524,63.5; M2EN 11.684,63.5; M2INA 9.144,63.5; M2INB 6.604,63.5; M2PWM 4.064,63.5; NC 1.524,37.084; RESET 1.524,32.004; VDD 26.924,63.5; VIN 1.524,19.304; VOUT 29.464,63.5
SHF-105-01-X-D-TH = drill 0.737 pad 1.067: 1 -2.54,-0.635; 2 -2.54,0.635; 3 -1.27,-0.635; 4 -1.27,0.635; 5 0,-0.635; 6 0,0.635; 7 1.27,-0.635; 8 1.27,0.635; 9 2.54,-0.635; 10 2.54,0.635
0204/7 = drill 0.813 octagon: 1 -3.81,0; 2 3.81,0
CUI_UJ2-MIBH2-4-SMT-TR = smd 0.4 x 1.2: 1 -1.3,2.1; 2 -0.65,2.1; 3 0,2.1; 4 0.65,2.1; 5 1.3,2.1 | drill 0.6 pad 1.2 long: SH1 -3.5,0.55; SH4 3.5,0.55 | drill 0.65 pad 1.1 long: SH2 -2.225,2.65; SH3 2.225,2.65 | smd 3 x 0.9: SH5 0,0.55
TO-220 = drill 1.524 pad 2.032 square: 1 -5.105,-1.524 | drill 1.524 pad 2.032: 2 -2.54,-1.524; 3 0,-1.524
XBEE = drill 0.8 pad 1.27: 1 -11,9; 2 -11,7; 3 -11,5; 4 -11,3; 5 -11,1; 6 -11,-1; 7 -11,-3; 8 -11,-5; 9 -11,-7; 10 -11,-9; 11 11,-9; 12 11,-7; 13 11,-5; 14 11,-3; 15 11,-1; 16 11,1; 17 11,3; 18 11,5; 19 11,7; 20 11,9

### Placement (x,y rotation side)
BRAKE_PRESSURE  12.7,66.04 270 top
C1  29.21,130.81 270 top
C2  34.29,130.81 270 top
DAQ  1.27,91.44 0 top
DAQ_BUTTONS_LEDS  76.2,3.81 90 top
DIFF_LINE_REC  12.7,125.73 0 top
ECVT  1.27,72.39 0 top
ECVT_BUTTONS_LEDS  76.2,38.1 90 top
LEVEL_SHIFT  31.75,38.1 0 top
MOTOR_DRIVER  19.05,1.27 0 top
PENC  3.81,132.08 270 top
R1  38.1,55.88 180 top
R2  50.8,55.88 0 top
R3  38.1,50.8 0 top
R4  50.8,50.8 180 top
R5  57.15,45.72 180 top
R6  57.15,43.18 0 top
SENC  3.81,116.84 270 top
SPARE_ANALOG_DAC  76.2,109.22 90 top
SPARE_ANALOG_PWM_I2C  76.2,74.93 90 top
USB  19.05,137.16 180 top
VOLT_REG  29.21,135.89 180 top
WHEEL_SPEED  12.7,31.75 270 top
XBEE  50.8,124.46 0 top

### Tracks (layer width: path | path; a pad name or v marks a point on that pad's centre or on a via)
+3V3  (via drill 0.35)
  Top 0.813: SPARE_ANALOG_DAC.1_A SPARE_ANALOG_DAC.1_B | v67.31,114.3 v69.85,111.76
  Bottom 0.61: 46.99,106.68 46.99,109.22 | 60.96,114.3 62.23,114.3
  Bottom 0.813: SPARE_ANALOG_PWM_I2C.1_A SPARE_ANALOG_PWM_I2C.1_B | SPARE_ANALOG_PWM_I2C.1_A 69.85,68.58 48.26,68.58 | MOTOR_DRIVER.VDD 45.97,66.29 48.26,68.58 | VOLT_REG.2 31.75,135.89 | 31.75,135.89 31.75,129.54 13.97,111.76 11.43,111.76 DAQ.3V3_LO | v31.75,41.91 31.75,63.75 MOTOR_DRIVER.M2EN | v31.75,34.29 31.75,33.02 29.46,30.73 MOTOR_DRIVER.3V3 | DAQ.3V3 38.1,93.98 46.99,102.87 46.99,106.68 | 46.99,109.22 52.07,114.3 60.96,114.3 | 62.23,114.3 v67.31,114.3 | v69.85,111.76 72.39,109.22 | 72.39,109.22 SPARE_ANALOG_DAC.1_A | SPARE_ANALOG_PWM_I2C.1_A 72.39,78.74 72.39,109.22 | 31.75,135.89 33.02,134.62 35.56,134.62 38.1,137.16 76.2,137.16 | ECVT.3V3 43.18,68.58 48.26,68.58
  pour Top (rank 2): 30.48,130.81 38.1,130.81 40.64,133.35 40.64,139.7 30.48,139.7
  pour Top: 29.21,33.02 34.29,33.02 34.29,43.18 29.21,43.18
  pour Bottom: 73.66,72.39 86.36,72.39 86.36,139.7 73.66,139.7
  pour Bottom (rank 2): 6.35,109.22 8.89,109.22 8.89,87.63 6.35,87.63
  pour Bottom: 29.21,63.5 52.07,63.5 52.07,66.04 29.21,66.04
+5V  (via drill 0.35)
  Top 0.406: DIFF_LINE_REC.16 14.46,130.18 12.55,128.27 9.1,128.27 8.89,128.06 8.89,127.21 9.73,126.36 DIFF_LINE_REC.4
  Top 0.813: WHEEL_SPEED.1_B WHEEL_SPEED.1_A 16.26,28.19 MOTOR_DRIVER.5V | DIFF_LINE_REC.16 18.41,130.18 v20.32,132.08
  Bottom 0.813: ECVT_BUTTONS_LEDS.1_A ECVT_BUTTONS_LEDS.1_B | BRAKE_PRESSURE.1_B BRAKE_PRESSURE.1_A | PENC.2 10.16,134.62 12.7,132.08 v20.32,132.08 v21.59,132.08 22.86,132.08 24.13,130.81 24.13,125.73 16.51,118.11 12.7,118.11 | SENC.2 5.08,119.38 6.35,118.11 12.7,118.11 | 12.7,118.11 5.08,110.49
  pour Bottom: 2.54,0 86.36,0 86.36,68.58 81.28,68.58 81.28,3.81 7.62,3.81 7.62,68.58 6.35,68.58 6.35,111.76 3.81,111.76 3.81,68.58 2.54,68.58
  pour Top: 19.05,139.7 19.05,130.81 30.48,130.81 30.48,139.7
+12V  (via drill 0.35)
  Top 0.813: LEVEL_SHIFT.16 37.47,42.55 v38.1,43.18
  Bottom 0.813: DAQ_BUTTONS_LEDS.2_A DAQ_BUTTONS_LEDS.2_B | ECVT_BUTTONS_LEDS.2_A ECVT_BUTTONS_LEDS.2_B | BRAKE_PRESSURE.2_B BRAKE_PRESSURE.2_A | 76.2,67.31 51.05,67.31 MOTOR_DRIVER.VOUT 44.7,60.96 44.7,49.78 v38.1,43.18
  pour Bottom (rank 2): 10.16,68.58 15.24,68.58 15.24,7.62 73.66,7.62 73.66,68.58 78.74,68.58 78.74,3.81 10.16,3.81
BACKSHIFT_LED_12V_W/O_RES
  Top 0.406: LEVEL_SHIFT.11 41.27,36.2 48.26,43.18 R6.1
BKSHIFT_LED
  Top 0.406: ECVT.4/CANRX 10.79,69.22 10.79,50.16 12.06,48.9 36.2,48.9 40.64,44.45 40.64,41.91 38.1,39.37 33.9,39.37 33.02,38.49 33.02,35.56 33.66,34.92 LEVEL_SHIFT.10
BKSHIFT_LED_12V
  Top 0.406: ECVT_BUTTONS_LEDS.5_A R6.2
  Bottom 0.813: ECVT_BUTTONS_LEDS.5_A ECVT_BUTTONS_LEDS.5_B
DAQ_ECVT_CS
  pour Top (rank 3): 57.15,72.39 59.69,72.39 59.69,93.98 57.15,93.98
DAQ_ECVT_MISO
  Top 0.406: DAQ.1/TX 6.35,91.44 6.35,74.93 ECVT.1/TX
DAQ_ECVT_MOSI
  Top 0.406: DAQ.0/RX 3.81,91.44 3.81,74.93 ECVT.0/RX
DAQ_ECVT_RX
  Bottom 0.406: DAQ.9/CS 27.94,91.44 29.21,90.17 29.21,86.36 30.48,85.09 ECVT.10/CS
DAQ_ECVT_SCK
  pour Top (rank 4): 59.69,72.39 62.23,72.39 62.23,93.98 59.69,93.98
DAQ_ECVT_TX  (via drill 0.35)
  Top 0.406: DAQ.10/CS 30.48,91.44 31.75,90.17 31.75,87.63 v29.21,85.09 | v29.21,76.2 27.94,74.93 ECVT.9/CS
  Bottom 0.406: v29.21,85.09 v29.21,76.2
DAQ_SPARE_A16_PWM
  Top 0.406: DAQ.35/A16 61.59,102.23 76.83,102.23 80.64,98.42 80.64,84.45 SPARE_ANALOG_PWM_I2C.2_A
  Bottom 0.813: SPARE_ANALOG_PWM_I2C.2_A SPARE_ANALOG_PWM_I2C.2_B
DAQ_SPARE_A17_PWM
  Top 0.406: DAQ.36/A17 62.87,98.42 76.83,98.42 79.38,95.89 79.38,88.27 SPARE_ANALOG_PWM_I2C.3_A
  Bottom 0.813: SPARE_ANALOG_PWM_I2C.3_A SPARE_ANALOG_PWM_I2C.3_B
DAQ_SPARE_A18_PWM_SCL
  Top 0.406: DAQ.37/A18 61.59,97.16 76.83,97.16 78.11,95.89 78.11,92.08 SPARE_ANALOG_PWM_I2C.4_A
  Bottom 0.813: SPARE_ANALOG_PWM_I2C.4_A SPARE_ANALOG_PWM_I2C.4_B
DAQ_SPARE_A19_PWM_SDA
  Top 0.406: DAQ.38/A19 60.96,95.25 SPARE_ANALOG_PWM_I2C.5_A
  Bottom 0.813: SPARE_ANALOG_PWM_I2C.5_A SPARE_ANALOG_PWM_I2C.5_B
DAQ_SPARE_A21_DAC0
  Top 0.406: DAQ.21/DAC0 44.45,109.22 71.12,109.22 SPARE_ANALOG_DAC.2_A
  Top 0.813: SPARE_ANALOG_DAC.2_A SPARE_ANALOG_DAC.2_B
DAQ_SPARE_A22_DAC1
  Top 0.406: DAQ.A22/DAC1 43.18,110.49 69.85,110.49 74.93,115.57 74.93,118.11 SPARE_ANALOG_DAC.3_A
  Top 0.813: SPARE_ANALOG_DAC.3_A SPARE_ANALOG_DAC.3_B
DAQ_XBEE_CS  (via drill 0.35)
  Top 0.406: XBEE.17 57.99,127.46 v52.45,121.92 | v48.26,121.92 40.64,114.3 34.29,114.3 30.48,110.49 DAQ.15/A1
  Bottom 0.406: v52.45,121.92 v48.26,121.92
DAQ_XBEE_MISO  (via drill 0.35)
  Top 0.406: v36.83,104.14 v36.83,101.6
  Bottom 0.406: XBEE.4 36.83,124.49 v36.83,104.14 | v36.83,101.6 36.83,100.33 35.56,99.06 DAQ.12/MISO
DAQ_XBEE_MOSI
  Bottom 0.406: XBEE.11 45.61,115.46 39.37,109.22 39.37,105.41 33.02,99.06 DAQ.11/MOSI
DAQ_XBEE_RX
  Bottom 0.406: XBEE.2 31.75,123.41 31.75,106.68 22.86,97.79 DAQ.7
DAQ_XBEE_SCK
  Top 0.406: DAQ.14/A0 33.02,110.49 35.56,113.03 41.56,113.03 57.99,129.46 XBEE.18
DAQ_XBEE_TX
  Bottom 0.406: XBEE.3 34.29,123.95 34.29,106.68 33.02,105.41 31.75,105.41 26.67,100.33 26.67,99.06 25.4,97.79 DAQ.8
ECVT_SPARE_A21_DAC0  (via drill 0.35)
  Top 0.406: ECVT.21/DAC0 43.18,87.63 44.45,86.36 50.8,86.36 52.07,87.63 v52.07,100.33
  Top 0.813: SPARE_ANALOG_DAC.4_A SPARE_ANALOG_DAC.4_B
  Bottom 0.406: SPARE_ANALOG_DAC.4_A 73.66,121.92 73.66,116.84 68.58,111.76 54.61,111.76 52.07,109.22 v52.07,100.33
ECVT_SPARE_A22_DAC1  (via drill 0.35)
  Top 0.406: v49.53,100.33 v49.53,87.63
  Top 0.813: SPARE_ANALOG_DAC.5_A SPARE_ANALOG_DAC.5_B
  Bottom 0.406: SPARE_ANALOG_DAC.5_A 72.39,125.73 72.39,118.11 67.31,113.03 53.34,113.03 49.53,109.22 v49.53,100.33 | v49.53,87.63 46.99,85.09 43.18,85.09 40.64,87.63 ECVT.A22/DAC1
ENGINE_SPEED
  Top 0.813: WHEEL_SPEED.2_B WHEEL_SPEED.2_A
  Bottom 0.406: WHEEL_SPEED.2_A 16.51,30.48 16.51,72.39 ECVT.5 15.24,76.2 15.24,83.82 16.51,85.09 16.51,91.44 DAQ.5
FBRAKE_PRESSURE  (via drill 0.35)
  Top 0.406: v63.5,83.82 63.5,64.77 55.88,57.15 48.26,57.15 R2.1 R1.1
  Bottom 0.406: v63.5,83.82 ECVT.34/A15
  pour Bottom: 57.15,109.22 57.15,87.63 59.69,87.63 59.69,109.22
FBRAKE_PRESSURE_W/O_RES
  Top 0.406: BRAKE_PRESSURE.3_A R1.2
  Bottom 0.813: BRAKE_PRESSURE.3_B BRAKE_PRESSURE.3_A
FLWHEEL_SPEED  (via drill 0.35)
  Top 0.406: ECVT.29 v53.34,64.77
  Top 0.813: WHEEL_SPEED.4_B WHEEL_SPEED.4_A
  Bottom 0.406: WHEEL_SPEED.4_A 16.51,20.32 16.51,24.13 19.13,26.75 28.02,26.75 49.53,48.26 49.53,60.96 v53.34,64.77
  pour Top: 52.07,72.39 54.61,72.39 54.61,93.98 52.07,93.98
FRWHEEL_SPEED  (via drill 0.35)
  Top 0.406: ECVT.30 v55.88,64.77
  Top 0.813: WHEEL_SPEED.5_B WHEEL_SPEED.5_A
  Bottom 0.406: WHEEL_SPEED.5_A 17.78,16.51 17.78,22.86 19.48,24.56 28.37,24.56 52.07,48.26 52.07,60.96 v55.88,64.77
  pour Top (rank 2): 54.61,72.39 57.15,72.39 57.15,93.98 54.61,93.98
GND  (via drill 0.35)
  Top 0.406: DIFF_LINE_REC.12 15.38,125.41 | DIFF_LINE_REC.8 9.7,120.65
  Top 0.813: 15.38,125.41 v17.78,125.41 | 9.7,120.65 v8.89,120.65
  pour Top (rank 6): -1.27,-1.27 90.17,-1.27 90.17,140.97 -1.27,140.97
  pour Bottom (rank 6): -1.27,-1.27 90.17,-1.27 90.17,140.97 -1.27,140.97
LAUNCH_CONTROL_BUTTON  (via drill 0.35)
  Top 0.406: v15.24,67.31 20.32,62.23 v57.15,62.23
  Top 0.813: ECVT_BUTTONS_LEDS.3_A ECVT_BUTTONS_LEDS.3_B
  Bottom 0.406: v15.24,67.31 15.24,68.58 ECVT.2 | v57.15,62.23 62.23,62.23 ECVT_BUTTONS_LEDS.3_A
LOGGER_BUTTON  (via drill 0.35)
  Top 0.406: DAQ.2 13.97,96.52 29.21,96.52 31.75,93.98 v31.75,92.71 | v71.12,73.66 73.66,71.12 80.01,71.12 87.63,63.5 87.63,17.78 DAQ_BUTTONS_LEDS.3_B
  Bottom 0.406: v31.75,92.71 31.75,92.08 32.38,91.44 55.88,91.44 57.15,90.17 57.15,87.63 v71.12,73.66
  Bottom 0.813: DAQ_BUTTONS_LEDS.3_A DAQ_BUTTONS_LEDS.3_B
LOGGING_STATUS_LED
  Top 0.406: DAQ.4/CANRX 13.97,91.44 10.16,91.44 8.89,90.17 8.89,72.39 7.62,71.12 7.62,46.99 11.43,43.18 24.61,43.18 27.78,40.01 LEVEL_SHIFT.3
LOGGING_STATUS_LED_12V
  Top 0.406: LEVEL_SHIFT.4 29.84,38.73 30.48,38.1 30.48,33.02 40.64,22.86 69.85,22.86 71.12,24.13 DAQ_BUTTONS_LEDS.5_A
  Bottom 0.813: DAQ_BUTTONS_LEDS.5_A DAQ_BUTTONS_LEDS.5_B
MARKER_BUTTON  (via drill 0.35)
  Top 0.406: DAQ.3/CANTX 15.24,95.25 27.94,95.25 29.21,93.98 v29.21,92.71 | v69.85,72.39 72.39,69.85 80.01,69.85 86.36,63.5 86.36,21.59 DAQ_BUTTONS_LEDS.4_B
  Bottom 0.406: v29.21,92.71 29.21,91.44 30.48,90.17 53.98,90.17 54.61,89.53 54.61,87.63 v69.85,72.39
  Bottom 0.813: DAQ_BUTTONS_LEDS.4_A DAQ_BUTTONS_LEDS.4_B
N$40
  Top 0.813: USB.SH3 15.55,135.78 USB.SH4 USB.SH5 USB.SH1 22.55,135.78 USB.SH2
PENC_A  (via drill 0.35)
  Top 0.406: ECVT.24 40.64,74.93 34.29,81.28 34.29,93.98 v30.48,97.79 | DIFF_LINE_REC.3 11.43,127.64 v12.06,127 | v19.05,124.46 20.32,124.46 26.67,118.11 26.67,106.68 v30.48,102.87
  Bottom 0.406: v12.06,127 14.61,124.46 v19.05,124.46 | v30.48,102.87 v30.48,97.79
PENC_B  (via drill 0.35)
  Top 0.406: ECVT.25 43.18,74.93 36.83,81.28 36.83,93.98 31.75,99.06 29.21,99.06 21.59,106.68 21.59,118.11 17.78,121.92 v16.51,121.92 | DIFF_LINE_REC.5 11.43,125.09 v12.06,124.46
  Bottom 0.406: v12.06,124.46 12.06,123.83 13.97,121.92 v16.51,121.92
PENC_CHA
  Top 0.406: PENC.6 5.08,132.08 8.26,128.91 DIFF_LINE_REC.2
PENC_CHA/
  Top 0.406: PENC.5 2.88,132.37 2.77,132.37 2.2,132.94 2.2,135.03 2.77,135.6 4.92,135.6 DIFF_LINE_REC.1
PENC_CHB
  Top 0.406: PENC.8 4.74,130.52 4.85,130.52 8.16,127.21 8.16,125.4 9.73,123.83 DIFF_LINE_REC.6
PENC_CHB/
  Top 0.406: DIFF_LINE_REC.7 8.78,122.56 2.2,129.13 2.2,129.94 2.77,130.52 2.88,130.52 PENC.7
PMOT_CS
  Bottom 0.406: ECVT.16/A2 27.94,76.2 29.21,74.93 29.21,68.83 MOTOR_DRIVER.M1CS
PMOT_INA
  Top 0.406: ECVT.18/A4/SDA 36.83,74.93 36.83,68.58 40.64,64.77 MOTOR_DRIVER.M1INA
PMOT_INB
  Top 0.406: ECVT.19/A5/SCL 34.29,74.93 34.29,68.58 38.1,64.77 MOTOR_DRIVER.M1INB
PMOT_PWM  (via drill 0.35)
  Top 0.406: ECVT.22/A8 13.97,87.63 13.97,83.82 v16.51,81.28 | v21.59,81.28 25.4,81.28 31.75,74.93 31.75,68.58 35.56,64.77 MOTOR_DRIVER.M1PWM
  Bottom 0.406: v21.59,81.28 v16.51,81.28
RBRAKE_PRESSURE  (via drill 0.35)
  Top 0.406: v63.5,86.36 64.77,85.09 64.77,63.5 53.34,52.07 48.26,52.07 R4.2 R3.2
  Bottom 0.406: v63.5,86.36 ECVT.33/A14
  pour Bottom (rank 2): 59.69,87.63 62.23,87.63 62.23,109.22 59.69,109.22
RBRAKE_PRESSURE_W/O_RES
  Top 0.406: BRAKE_PRESSURE.4_A R3.1
  Bottom 0.813: BRAKE_PRESSURE.4_B BRAKE_PRESSURE.4_A
RWHEELS_SPEED
  Top 0.813: WHEEL_SPEED.3_B WHEEL_SPEED.3_A
  Bottom 0.406: WHEEL_SPEED.3_A 17.78,26.67 17.78,66.04 20.33,68.59 ECVT.6 | ECVT.6 20.33,74.92 22.86,77.45 22.86,83.82 21.59,85.09 21.59,91.44 DAQ.6 | ECVT.6
SENC_A
  Top 0.406: DIFF_LINE_REC.11 18.41,123.83 24.13,118.11 24.13,106.68 29.21,101.6 31.75,101.6 39.37,93.98 39.37,81.28 45.72,74.93 ECVT.26
SENC_B
  Top 0.406: DIFF_LINE_REC.13 20.95,126.36 29.21,118.11 29.21,106.68 41.91,93.98 41.91,81.28 48.26,74.93 ECVT.27
SENC_CHA  (via drill 0.35)
  Top 0.406: v8.89,116.84 8.89,116.99 14.46,122.56 DIFF_LINE_REC.10
  Bottom 0.406: v8.89,116.84 SENC.6
SENC_CHA/  (via drill 0.35)
  Top 0.406: v12.7,119.38 14.61,121.28 DIFF_LINE_REC.9
  Bottom 0.406: SENC.5 2.88,117.13 2.77,117.13 2.2,117.7 2.2,119.78 2.77,120.36 6.12,120.36 7.1,119.38 v12.7,119.38
SENC_CHB
  Top 0.406: DIFF_LINE_REC.14 14.46,127.64 13.61,126.79 13.61,122.69 6.79,115.86 4.74,115.86 SENC.8
SENC_CHB/
  Top 0.406: DIFF_LINE_REC.15 14.46,128.91 13.06,127.5 13.06,123.4 11.58,121.92 2.54,121.92 1.27,120.65 1.27,117.36 3.06,115.57 SENC.7
SMOT_CS
  Bottom 0.406: MOTOR_DRIVER.M2CS 20.57,66.29 26.67,72.39 26.67,87.63 ECVT.17/A3
SMOT_INA
  Top 0.406: ECVT.20/A6 20.32,86.36 20.32,78.74 24.13,74.93 24.13,68.58 27.94,64.77 MOTOR_DRIVER.M2INA
SMOT_INB
  Top 0.406: ECVT.21/A7 17.78,86.36 17.78,78.74 21.59,74.93 21.59,68.58 25.4,64.77 MOTOR_DRIVER.M2INB
SMOT_PWM
  Top 0.406: ECVT.23/A9 11.43,87.63 11.43,82.55 19.05,74.93 19.05,68.83 MOTOR_DRIVER.M2PWM
UPSHIFT_LED
  Top 0.406: LEVEL_SHIFT.14 36.4,40.01 39.37,42.98 39.37,43.81 35.56,47.62 12.06,47.62 9.53,50.16 9.53,70.48 ECVT.3/CANTX
UPSHIFT_LED_12V
  Top 0.406: R5.1 75.56,60.33 76.83,60.33 78.11,59.05 78.11,55.24 ECVT_BUTTONS_LEDS.4_A
  Bottom 0.813: ECVT_BUTTONS_LEDS.4_A ECVT_BUTTONS_LEDS.4_B
UPSHIFT_LED_12V_W/O_RES
  Top 0.406: LEVEL_SHIFT.13 38.73,38.73 45.72,45.72 R5.2

### Text on the board
tNames: DESIGNED BY / RAHUL GOYAL / DEC 2019 | SEE BOTTOM FOR PORT LABELS
bNames: DESIGNED BY / RAHUL GOYAL / DEC 2019 | GND / / ECVT A22 DAC1 / / ECVT A21 DAC0 / / DAQ A22 DAC1 / / DAQ A21 DAC0 / / +3V3 IN/OUT | GND / / DAQ A19 PWM SDA / / DAQ A18 PWM SCL / / DAQ A17 PWM / / DAQ A16 PWM / / +3V3 IN/OUT | +5V IN/OUT / / +12V OUT / / FBRAKE IN / / RBRAKE IN / / GND / / GND | GND / / BKSHIFT LED OUT / / UPSHIFT LED OUT / / LCHCTRL BUT IN / / +12V OUT / / +5V IN/OUT | +5V IN/OUT / / ENGINE IN / / RWHEELS IN / / FLWHEEL IN / / FRWHEEL IN / / GND | GND / / LOG STATUS LED OUT / / MARKER BUTTON IN / / LOGGER BUTTON IN / / +12V OUT / / +5V IN/OUT